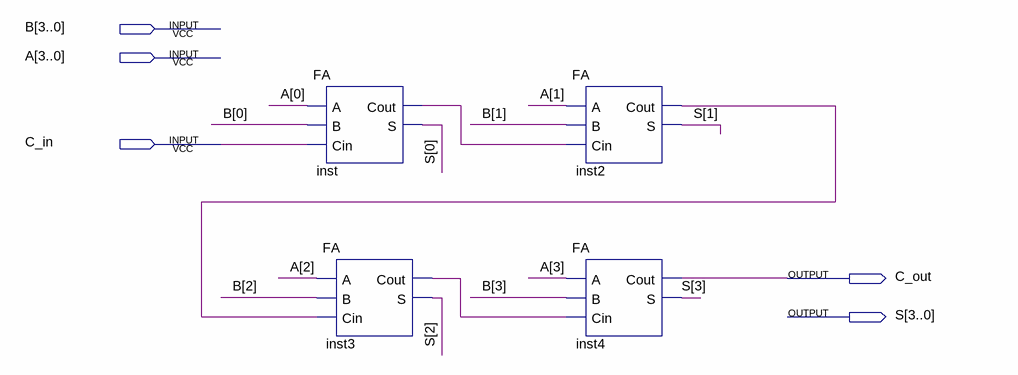
[diagram p0: schematic sheet]
// Quartus schematic Ripple_Adder_4bit.bdf as structural Verilog: 4 symbols, 5 pins
module Ripple_Adder_4bit (
  input  [3:0] B,
  input  [3:0] A,
  input  C_in,
  output C_out,
  output [3:0] S
);

  wire inst2_cout, inst3_cout, inst_cout;

  FA inst (.A(A[0]), .B(B[0]), .Cin(C_in), .Cout(inst_cout), .S(S[0]));
  FA inst3 (.A(A[2]), .B(B[2]), .Cin(inst2_cout), .Cout(inst3_cout), .S(S[2]));
  FA inst2 (.A(A[1]), .B(B[1]), .Cin(inst_cout), .Cout(inst2_cout), .S(S[1]));
  FA inst4 (.A(A[3]), .B(B[3]), .Cin(inst3_cout), .Cout(C_out), .S(S[3]));
endmodule
